# Altium schematic sheet SDRAM 2.SchDoc: SDRAM
size A4; Revision: 1; SheetNumber: 6; SheetTotal: 11; SheetSize: A4
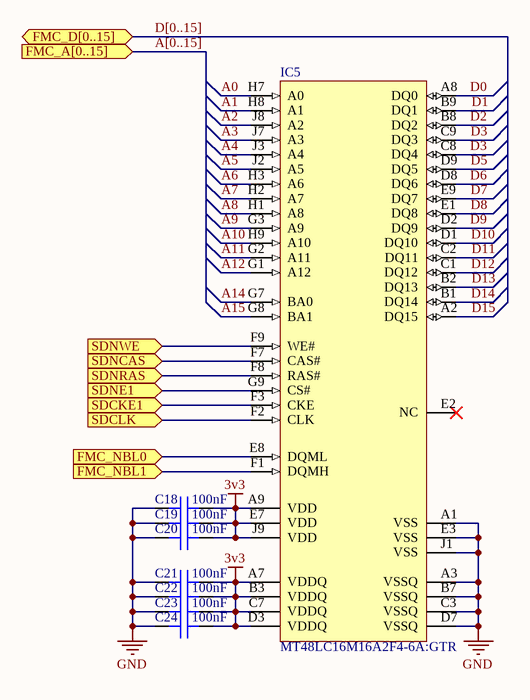
[diagram p0: SDRAM 2.SchDoc]

## Parts
C18  100nF  [CAP 0603/1608]
C19  100nF  [CAP 0603/1608]
C20  100nF  [CAP 0603/1608]
C21  100nF  [CAP 0603/1608]
C22  100nF  [CAP 0603/1608]
C23  100nF  [CAP 0603/1608]
C24  100nF  [CAP 0603/1608]
IC5  MT48LC16M16A2F4-6A:GTR  [MICRON VFBGA-54 8X14MM]

## Ports
FMC_A[0..15] (in), FMC_D[0..15] (bidir), FMC_NBL0 (in), FMC_NBL1 (in), SDCKE1 (in), SDCLK (in), SDNCAS (in), SDNE1 (in), SDNRAS (in), SDNWE (in)

## Nets
3v3: C18.1 C19.1 C20.1 C21.1 C22.1 C23.1 C24.1 IC5.A7(VDDQ) IC5.A9(VDD) IC5.B3(VDDQ) IC5.C7(VDDQ) IC5.D3(VDDQ) IC5.E7(VDD) IC5.J9(VDD)
GND: C18.2 C19.2 C20.2 C21.2 C22.2 C23.2 C24.2 IC5.A1(VSS) IC5.A3(VSSQ) IC5.B7(VSSQ) IC5.C3(VSSQ) IC5.D7(VSSQ) IC5.E3(VSS) IC5.J1(VSS)
A0: IC5.H7(A0)
A1: IC5.H8(A1)
A2: IC5.J8(A2)
A3: IC5.J7(A3)
A4: IC5.J3(A4)
A5: IC5.J2(A5)
A6: IC5.H3(A6)
A7: IC5.H2(A7)
A8: IC5.H1(A8)
A9: IC5.G3(A9)
A10: IC5.H9(A10)
A11: IC5.G2(A11)
A12: IC5.G1(A12)
A14: IC5.G7(BA0)
A15: IC5.G8(BA1)
D0: IC5.A8(DQ0)
D1: IC5.B9(DQ1)
D2: IC5.B8(DQ2)
D3: IC5.C8(DQ4) IC5.C9(DQ3)
D5: IC5.D9(DQ5)
D6: IC5.D8(DQ6)
D7: IC5.E9(DQ7)
D8: IC5.E1(DQ8)
D9: IC5.D2(DQ9)
D10: IC5.D1(DQ10)
D11: IC5.C2(DQ11)
D12: IC5.C1(DQ12)
D13: IC5.B2(DQ13)
D14: IC5.B1(DQ14)
D15: IC5.A2(DQ15)
FMC_NBL0: IC5.E8(DQML) ; port FMC_NBL0
FMC_NBL1: IC5.F1(DQMH) ; port FMC_NBL1
SDCKE1: IC5.F3(CKE) ; port SDCKE1
SDCLK: IC5.F2(CLK) ; port SDCLK
SDNCAS: IC5.F7(CAS#) ; port SDNCAS
SDNE1: IC5.G9(CS#) ; port SDNE1
SDNRAS: IC5.F8(RAS#) ; port SDNRAS
SDNWE: IC5.F9(WE#) ; port SDNWE

Not connected (* = marked no-connect by the designer): IC5 E2(NC)*

## Buses and harness runs
bus A[0..15] = port FMC_A[0..15]
bus D[0..15] = port FMC_D[0..15]

## Notes on the sheet
- Title:
- Size:
- Project:
- Revision:
- Sheet
- of
- Date:
- YıLDıZ IoT
- Elperek Mahallesi
- Saray Sokak, No:12
- SAKARYA / TURKEY
- File:

## Library data of the parts
C18-C24 = Capacitor - Ceramic: Ceramic, SMT Capacitor; Manufacturer: Samsung; Manufacturer Part Number: CL10B104JB8NNNC; Tolerance: 5%; Voltage Rating: 50V; Dielectric: X7R; Supplier 1: Digi-Key; Supplier Part Number 1: 1276-1033-1-ND; Stock 1: 305374; Pricing 1: 1 = 0,10000, 10 = 0,04800, 100 = 0,02160, 500 = 0,01540, 1000 = 0,01210 (USD); RoHS: Yes; Mount: Surface Mount; Case/Package: 0603; Case Code (Metric): 1608; Case Code (Imperial): 0603; Material: Ceramic; Contact Plating: Tin; Min Operating Temperature: -55°C; Max Operating Temperature: 125°C; Packaging: Tape and Reel; Package Quantity: 1; Capacitance: 100nF; Voltage: 50V; Length: 1.6mm; Height: 0.8mm; Width: 0.031inch; Thickness: 0.035inch; Depth: 0.8mm; Radiation Hardening: No; ComponentLink1URL: https://datasheet.ciiva.com/25793/cl10b104jb8nnnc-25793394.pdf?src-supplier=Digi-Key; ComponentLink1Description: https://datasheet.ciiva.com/25793/cl10b104jb8nnnc-25793394.pdf?src-supplier=Digi-Key; ComponentLink2URL: https://datasheet.ciiva.com/26838/getdatasheetpartid-359321-26838402.pdf?src-supplier=Verical; ComponentLink2Description: https://datasheet.ciiva.com/26838/getdatasheetpartid-359321-26838402.pdf?src-supplier=Verical; ComponentLink3URL: https://datasheet.ciiva.com/16498/cl10b104jb8nnnc-16498485.pdf?src-supplier=Future+Electronics; ComponentLink3Description: https://datasheet.ciiva.com/16498/cl10b104jb8nnnc-16498485.pdf?src-supplier=Future+Electronics; ComponentLink4URL: https://datasheet.ciiva.com/29199/456613-da-01-en-vs-kondensator-0603-29199008.pdf?src-supplier=Conrad; ComponentLink4Description: https://datasheet.ciiva.com/29199/456613-da-01-en-vs-kondensator-0603-29199008.pdf?src-supplier=Conrad
IC5 = MICRON 256Mb SDRAM: MT48LC64M4A2 – 16 Meg x 4 x 4 banks / MT48LC32M8A2 – 8 Meg x 8 x 4 banks / MT48LC16M16A2 – 4 Meg x 16 x 4 banks; Manufacturer: Alliance Memory; Supplier 1: Digi-Key; Supplier Part Number 1: 1450-1350-1-ND; Manufacturer Part Number: MT48LC16M16A2F4-6A:GTR; Stock 1: 1333; Pricing 1: 1 = 3,29000, 10 = 2,95500, 25 = 2,90800, 50 = 2,90020, 100 = 2,59150, 250 = 2,50728, 500 = 2,49792, 1000 = 2,32640 (USD); RoHS: No; ComponentLink1URL: https://media.digikey.com/pdf/Data%20Sheets/Alliance%20Memory%20PDFs/MT48LC64M4A2,%2032M8A2,%2016M16A2.pdf?src-supplier=Digi-Key; ComponentLink1Description: https://media.digikey.com/pdf/Data%20Sheets/Alliance%20Memory%20PDFs/MT48LC64M4A2,%2032M8A2,%2016M16A2.pdf?src-supplier=Digi-Key